# EAGLE schematic brain (EAGLE 7.7.0)
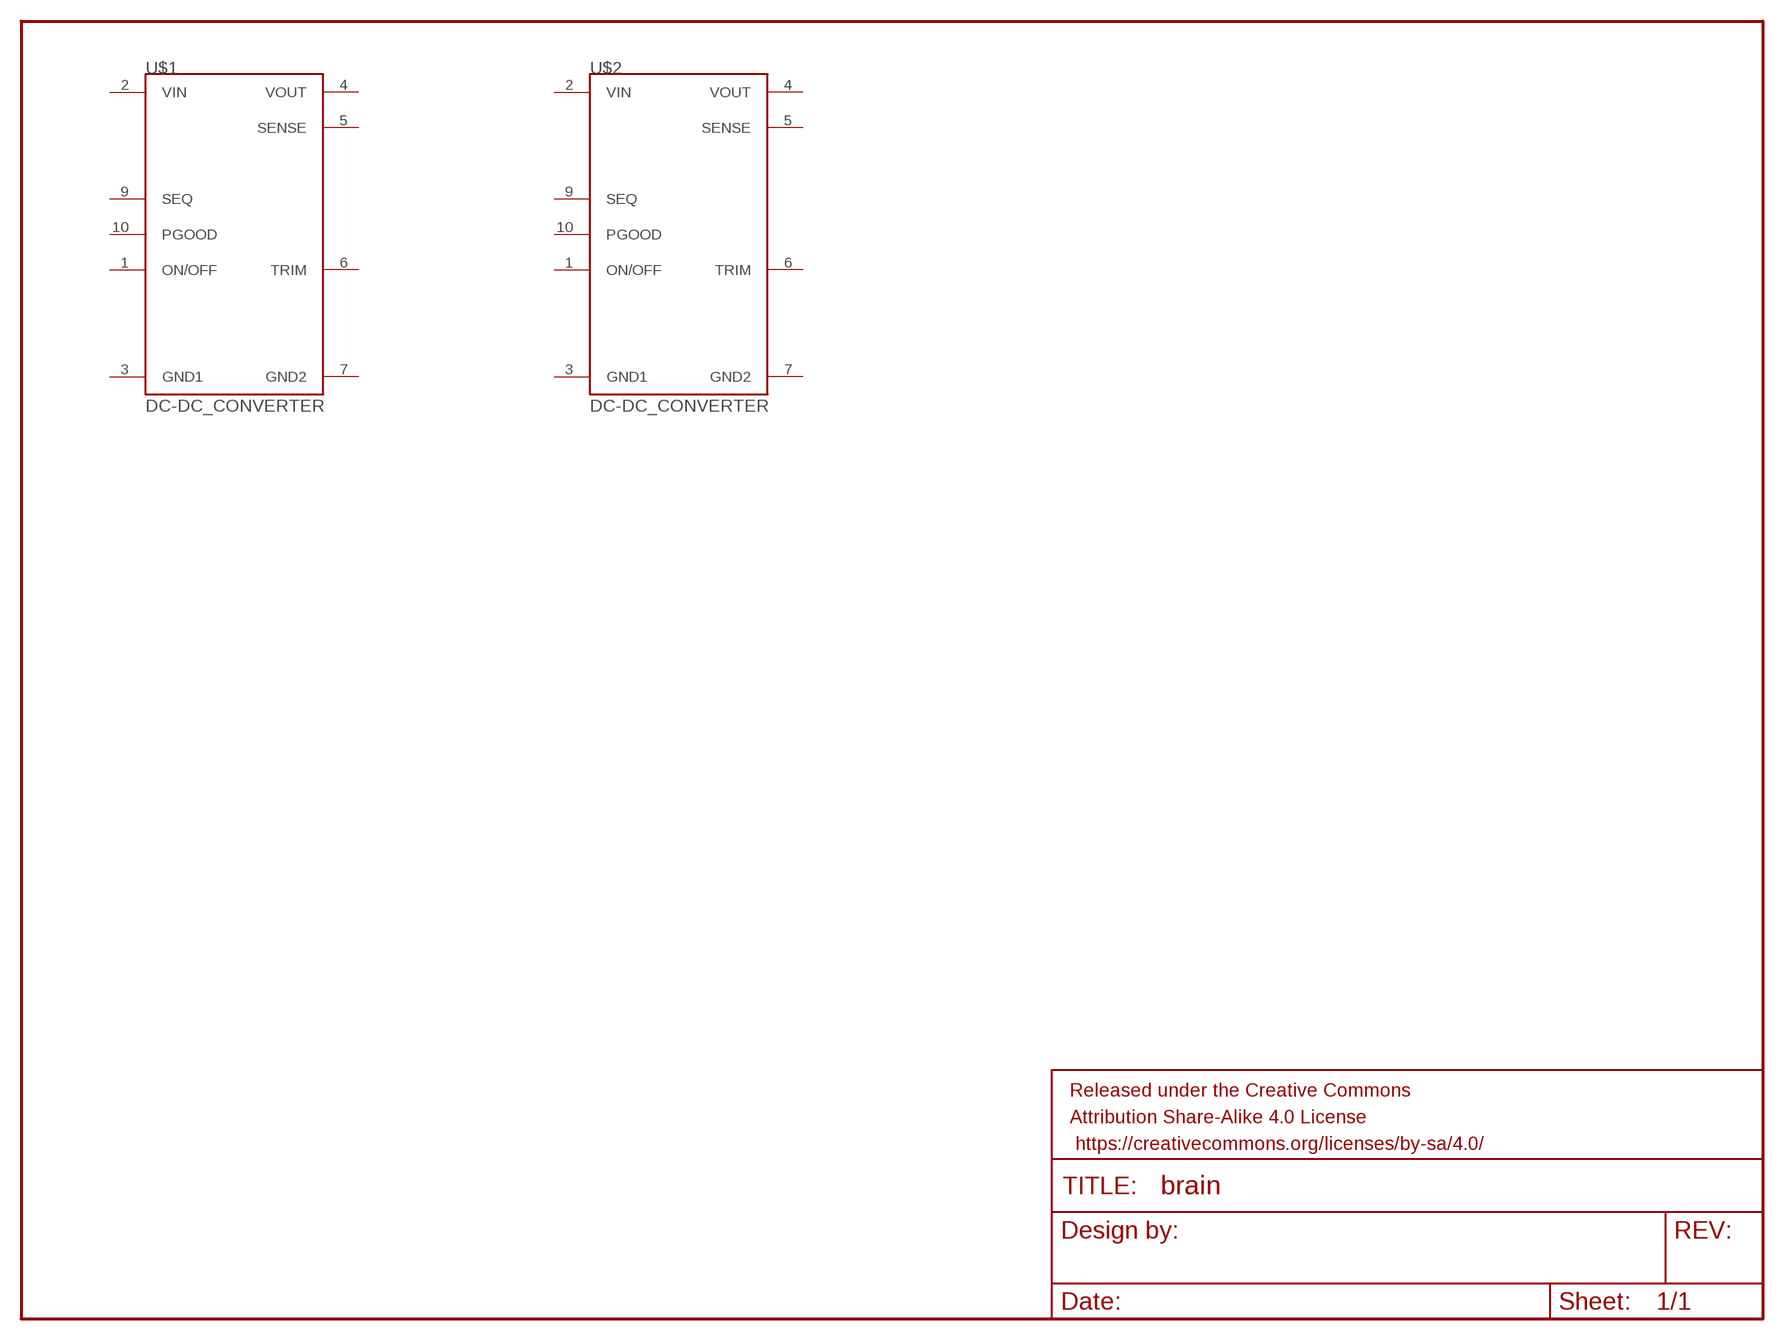
[diagram p0: schematic, sheet 1]

## Parts
FRAME1  FRAME-LETTER  [CREATIVE_COMMONS]
U$1  DC-DC_CONVERTER  [DC-DC_CONVERTER]
U$2  DC-DC_CONVERTER  [DC-DC_CONVERTER]
Unconnected: U$1.1(ON/OFF) U$1.2(VIN) U$1.3(GND1) U$1.4(VOUT) U$1.5(SENSE) U$1.6(TRIM) U$1.7(GND2) U$1.9(SEQ) U$1.10(PGOOD) U$2.1(ON/OFF) U$2.2(VIN) U$2.3(GND1) U$2.4(VOUT) U$2.5(SENSE) U$2.6(TRIM) U$2.7(GND2) U$2.9(SEQ) U$2.10(PGOOD)

## Library data of the parts
FRAME1 = SparkFun-Aesthetics:FRAME-LETTER: Schematic Frame - Letter Standard 8.5x11 US Letter frame
U$1 U$2 = SparkFun-IC-Power:DC-DC_CONVERTER: APTS006A0X-SRZ (IC-09258) Step-down 6A variable voltage switching module (TOL-09275)